# EAGLE design diyhue-IO (EAGLE 9.5.1)
COPYRIGHT: © 2016 luani.de; LICENSE: CC-BY-SA 4.0; PROJEKT: EPS8266 HV I/O Modul; REVISION: 1.0

## Sheet 1 of 2
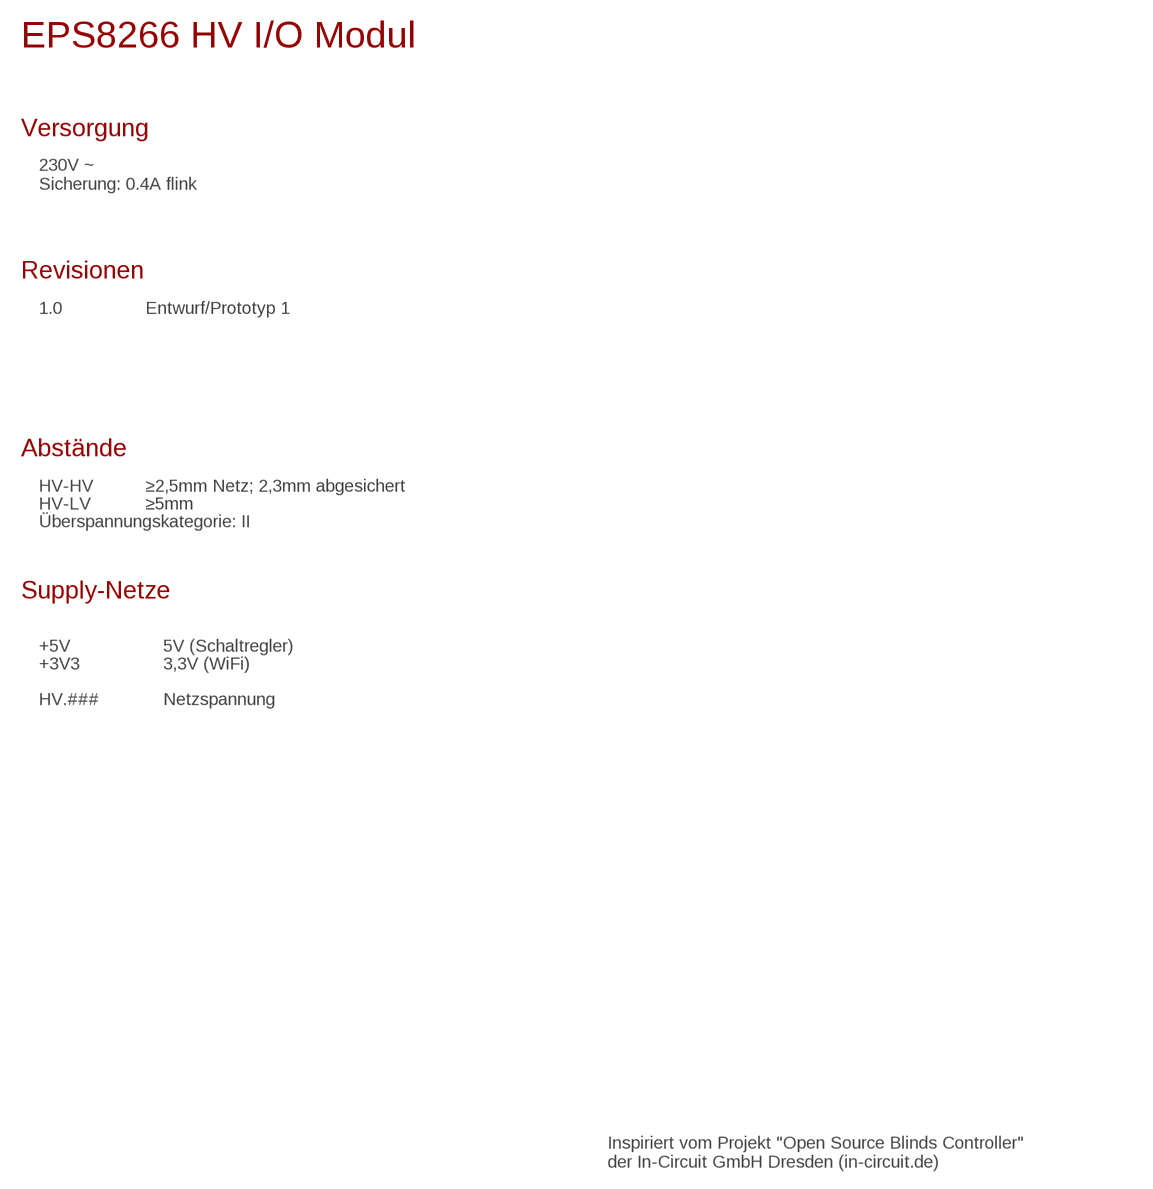
[diagram p0: schematic, sheet 1]

### Notes on the sheet
- Versorgung
- 230V ~
  Sicherung: 0.4A flink
- Revisionen
- 1.0 | Entwurf/Prototyp 1
- Abstände
- HV-HV | ≥2,5mm Netz; 2,3mm abgesichert
- HV-LV | ≥5mm
- Überspannungskategorie: II
- Supply-Netze
- +5V | 5V (Schaltregler)
- +3V3 | 3,3V (WiFi)
- HV.### | Netzspannung
- Inspiriert vom Projekt "Open Source Blinds Controller"
  der In-Circuit GmbH Dresden (in-circuit.de)

## Sheet 2 of 2
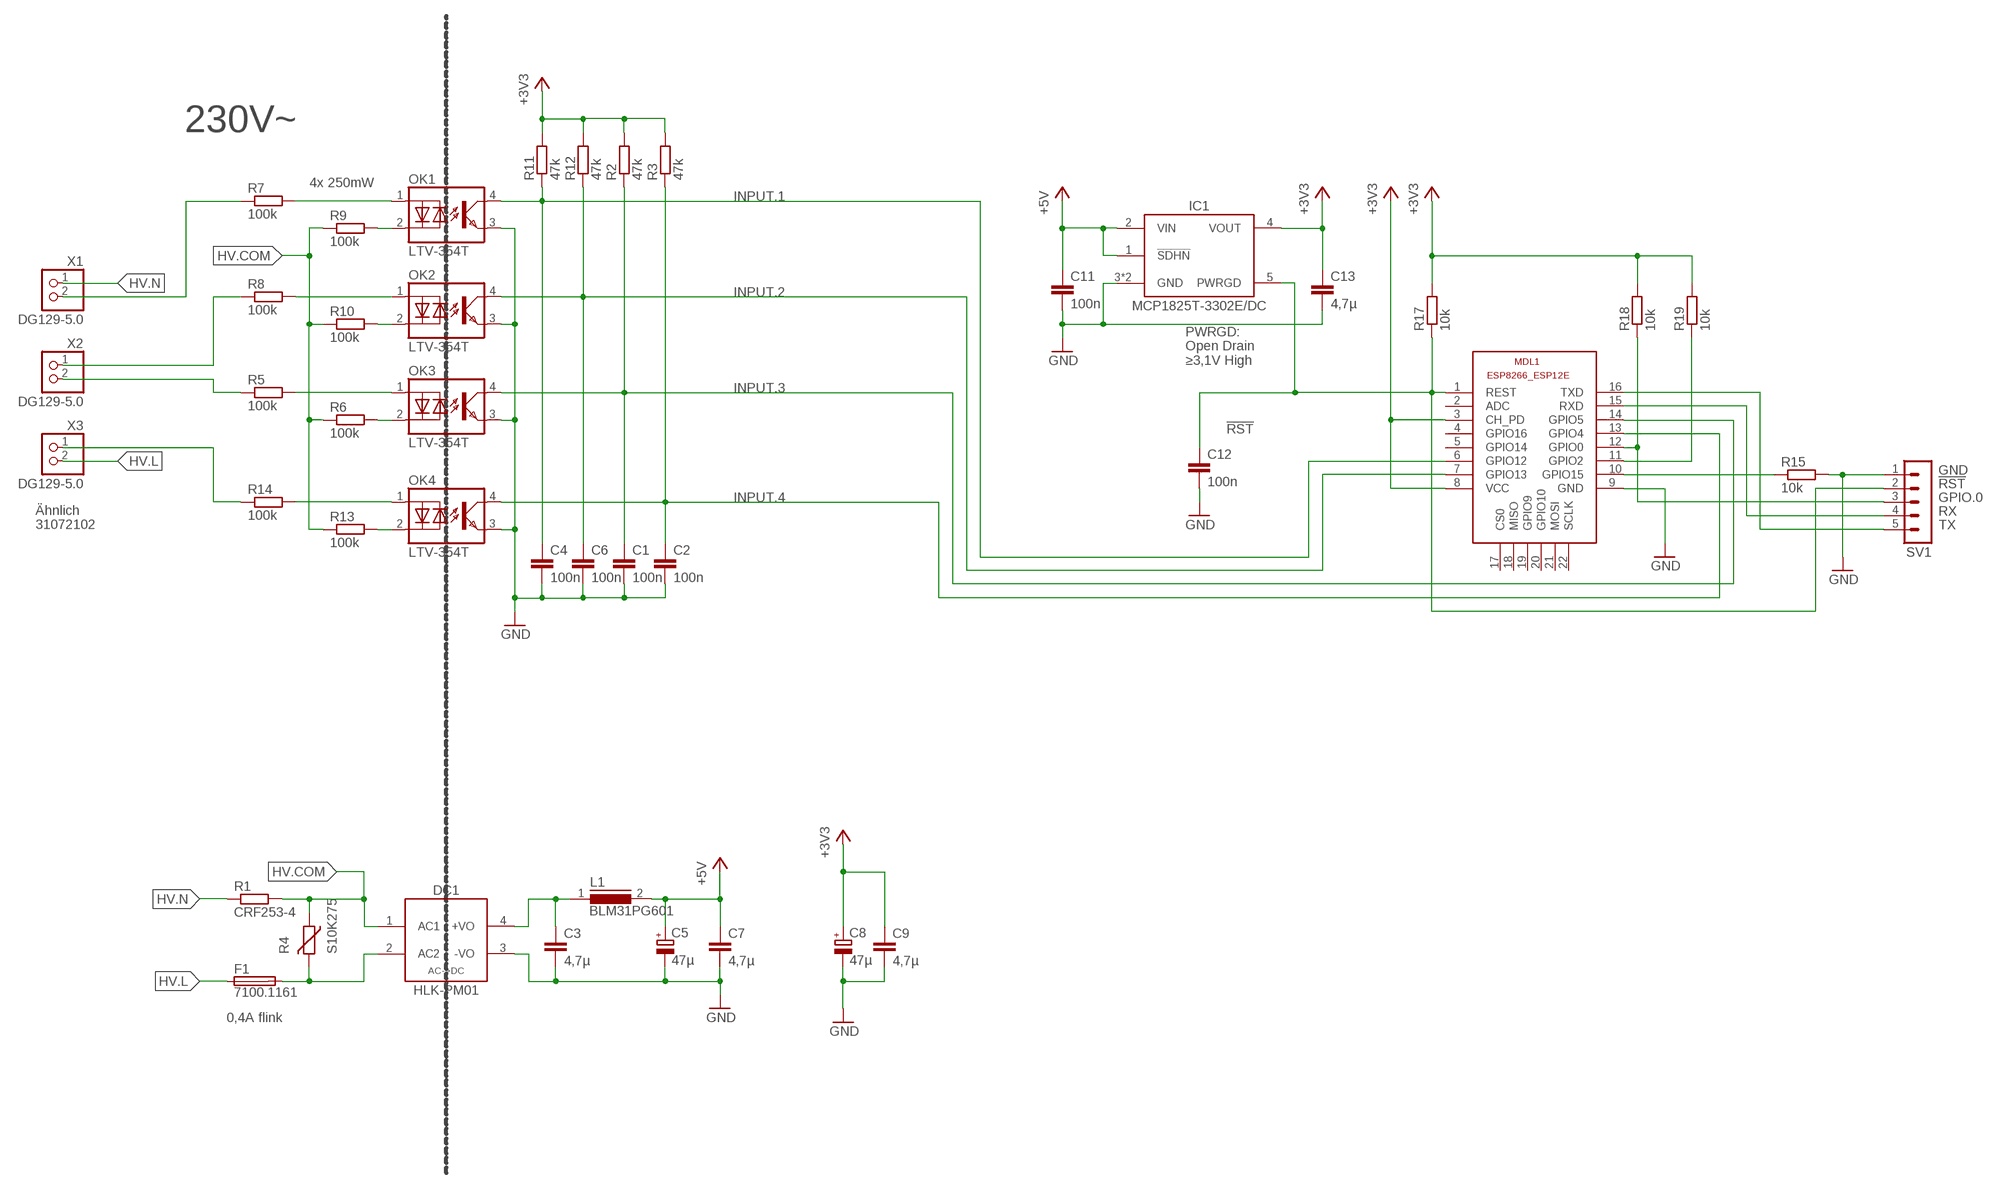
[diagram p1: schematic, sheet 2]

### Parts
C1  100n  C-EUC0805K  [C0805K]
C2  100n  C-EUC0805K  [C0805K]
C3  4,7µ  C-EUC0805K  [C0805K]
C4  100n  C-EUC0805K  [C0805K]
C5  47µ  CPOL-EUE2-5  [E2-5]
C6  100n  C-EUC0805K  [C0805K]
C7  4,7µ  C-EUC0805K  [C0805K]
C8  47µ  CPOL-EUE2-5  [E2-5]
C9  4,7µ  C-EUC0805K  [C0805K]
C11  100n  C-EUC0805K  [C0805K]
C12  100n  C-EUC0805K  [C0805K]
C13  4,7µ  C-EUC0805K  [C0805K]
DC1  HLK-PM01  ACDC-S-HLK_PM01  [HLK_PM01]
F1  7100.1161  FUSE-FRT250  [SCHURTER_FRT250]
IC1  MCP1825T-3302E/DC  MCP1825/DC  [SOT-223/5]
L1  BLM31PG601  INDUCTOR-BLM31  [BLM31P]
MDL1  ESP8266-12EESP8266-ESP12E  [ESP8266-ESP12E]
OK1  LTV-354T  OC-AC_LTV-354  [LITEON_LTV-354]
OK2  LTV-354T  OC-AC_LTV-354  [LITEON_LTV-354]
OK3  LTV-354T  OC-AC_LTV-354  [LITEON_LTV-354]
OK4  LTV-354T  OC-AC_LTV-354  [LITEON_LTV-354]
R1  CRF253-4  R-EU_0414/5V  [0414V]
R2  47k  R-EU_R0805W  [R0805W]
R3  47k  R-EU_R0805W  [R0805W]
R4  S10K275  VDR-S10K275  [EPCOS_S10K275]
R5  100k  R-EU_R1210  [R1210]
R6  100k  R-EU_R1210  [R1210]
R7  100k  R-EU_R1210  [R1210]
R8  100k  R-EU_R1210  [R1210]
R9  100k  R-EU_R1210  [R1210]
R10  100k  R-EU_R1210  [R1210]
R11  47k  R-EU_R0805W  [R0805W]
R12  47k  R-EU_R0805W  [R0805W]
R13  100k  R-EU_R1210  [R1210]
R14  100k  R-EU_R1210  [R1210]
R15  10k  R-EU_R0805W  [R0805W]
R17  10k  R-EU_R0805W  [R0805W]
R18  10k  R-EU_R0805W  [R0805W]
R19  10k  R-EU_R0805W  [R0805W]
SV1  MA05-1  [MA05-1]
X1  DG129-5.0  1PIN-2-31012102  [31012102]
X2  DG129-5.0  1PIN-2-31012102  [31012102]
X3  DG129-5.0  1PIN-2-31012102  [31012102]

### Nets
!RST: C12.1 IC1.5(PWRGD) MDL1.1(REST) R17.1 SV1.2
+3V3: C8.+ C9.1 C13.1 IC1.4(VOUT) MDL1.3(CH_PD) MDL1.8(VCC) R2.2 R3.2 R11.2 R12.2 R17.2 R18.2 R19.2
+5V: C5.+ C7.1 C11.1 IC1.1(!SDHN) IC1.2(VIN) L1.2
GND: C1.2 C2.2 C3.2 C4.2 C5.- C6.2 C7.2 C8.- C9.2 C11.2 C12.2 C13.2 DC1.3(-VO) IC1.3(GND) IC1.6(GND) MDL1.9(GND) OK1.3(E) OK2.3(E) OK3.3(E) OK4.3(E) R15.2 SV1.1
GPIO.0: MDL1.12(GPIO0) R18.1 SV1.3
GPIO.2: MDL1.11(GPIO2) R19.1
GPIO.15: MDL1.10(GPIO15) R15.1
HV.COM: DC1.1(AC1) R1.2 R4.1 R6.1 R9.1 R10.1 R13.1
HV.IN1: R7.1 X1.2
HV.IN2: R8.1 X2.1
HV.L: F1.1 X3.2
HV.N: R1.1 X1.1
HV.OUT1: R5.1 X2.2
HV.OUT2: R14.1 X3.1
INPUT.1: C4.1 MDL1.6(GPIO12) OK1.4(C) R11.1
INPUT.2: C6.1 MDL1.7(GPIO13) OK2.4(C) R12.1
INPUT.3: C1.1 MDL1.14(GPIO5) OK3.4(C) R2.1
INPUT.4: C2.1 MDL1.13(GPIO4) OK4.4(C) R3.1
N$1: C3.1 DC1.4(+VO) L1.1
N$2: DC1.2(AC2) F1.2 R4.2
N$12: OK3.2(CA) R6.2
N$13: OK4.2(CA) R13.2
N$14: OK4.1(AC) R14.2
N$16: OK1.2(CA) R9.2
N$17: OK2.2(CA) R10.2
N$18: OK1.1(AC) R7.2
N$19: OK2.1(AC) R8.2
N$20: OK3.1(AC) R5.2
RX: MDL1.15(RXD) SV1.4
TX: MDL1.16(TXD) SV1.5
Unconnected: MDL1.2(ADC) MDL1.4(GPIO16) MDL1.5(GPIO14) MDL1.17(CS0) MDL1.18(MISO) MDL1.19(GPIO9) MDL1.20(GPIO10) MDL1.21(MOSI) MDL1.22(SCLK)

### Notes on the sheet
- ⚠ 230V~
- 4x 250mW
- PWRGD:
  Open Drain
  ≥3,1V High
- Ähnlich
  31072102
- 0,4A flink

## Library data of the parts
C1-C4 C6 C7 C9 C11-C13 = rcl:C-EU: CAPACITOR, European symbol; SPICEPREFIX: C
C5 C8 = rcl:CPOL-EU: POLARIZED CAPACITOR, European symbol; SPICEPREFIX: C
DC1 = luani_modules:ACDC-S: AC->DC Converter, 1 Out
F1 = luani_protection:FUSE: Fuse
IC1 = luani_chips:MCP1825: Microchip LDO
L1 = leo_inductor-fastron:INDUCTOR: Fastron SMD Inductor Footprints: PIS4728, PIS2408, PIS2816, PISR, 1206, 1008
MDL1 = ESP8266-ESP12E:ESP8266-12E: ESP8266-12E with additional I/O and GPIO04/05 corrected The author cannot warrant that this library is free from error or will meet your specific requirements. Created by PuceBaboon.com. Komagane, Nagano, JAPAN
OK1-OK4 = luani_misc-smd:OC-AC: Optocoupler, AC Input
R1 = rcl:R-EU_: RESISTOR, European symbol
R2 R3 R5-R15 R17-R19 = rcl:R-EU_: RESISTOR, European symbol; SPICEPREFIX: R
R4 = luani_protection:VDR: Varistor
SV1 = con-lstb:MA05-1: PIN HEADER; OC_FARNELL: unknown; OC_NEWARK: unknown
X1-X3 = leo_con-ria:1PIN-2: 1 Pin Header, 2 Pole

## Net classes
1 HV-Netz: width 1 mm, clearance 5 mm to class 0, clearance 2.5 mm
2 HV-gesichert: width 0.3 mm, clearance 5 mm to class 0, clearance 2.3 mm to class 1, clearance 2.3 mm

## Board
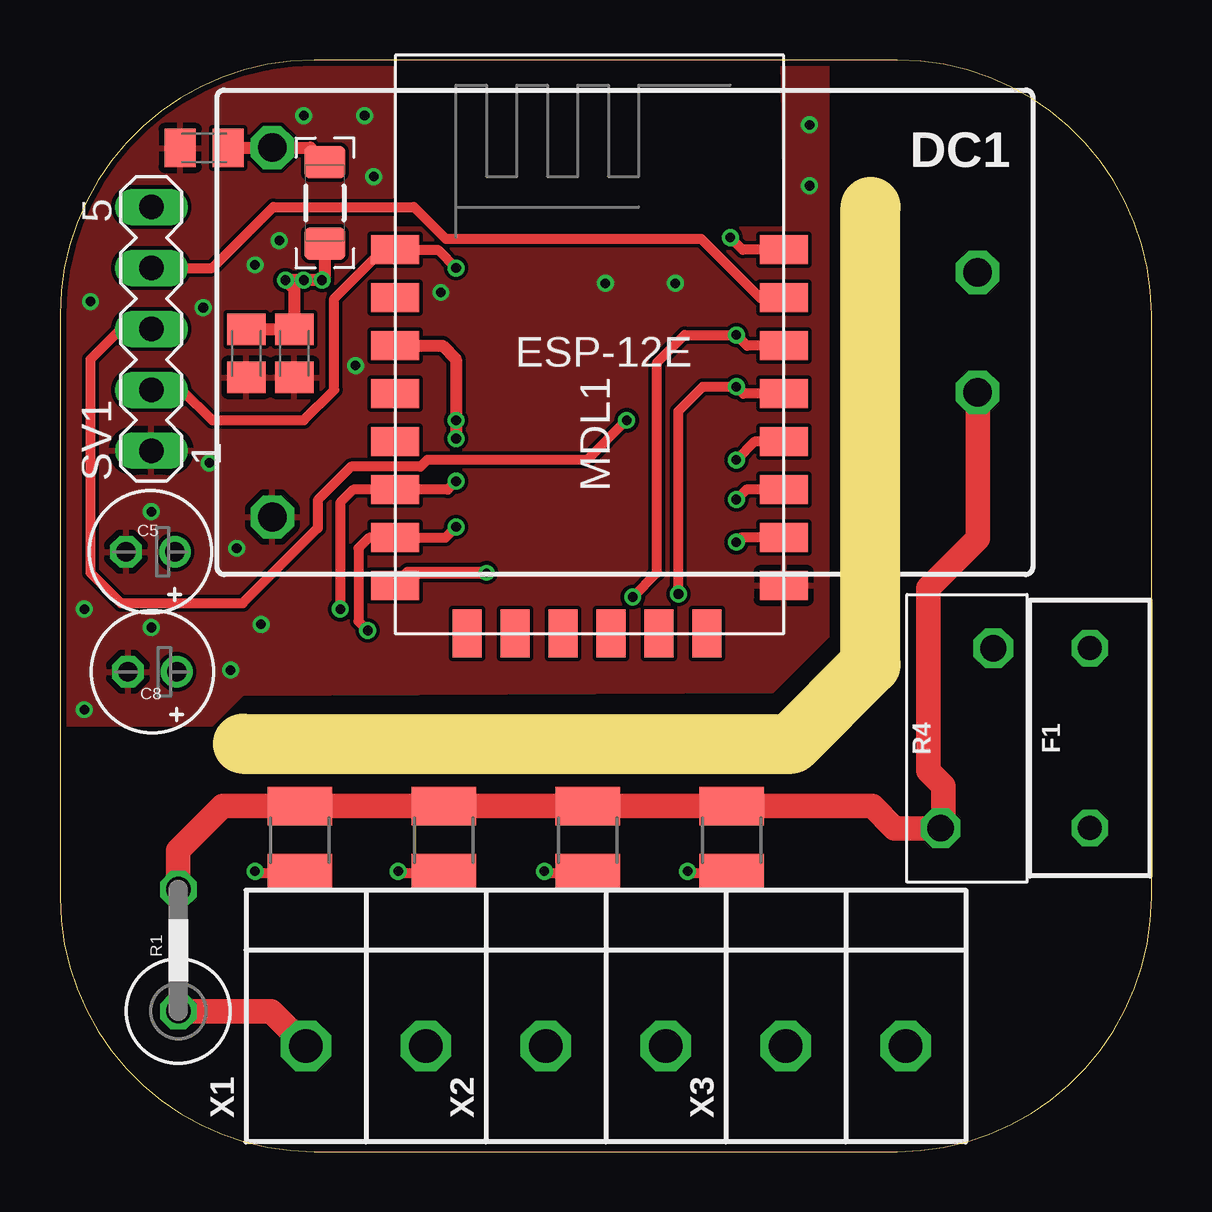
[diagram p2: board, top side]
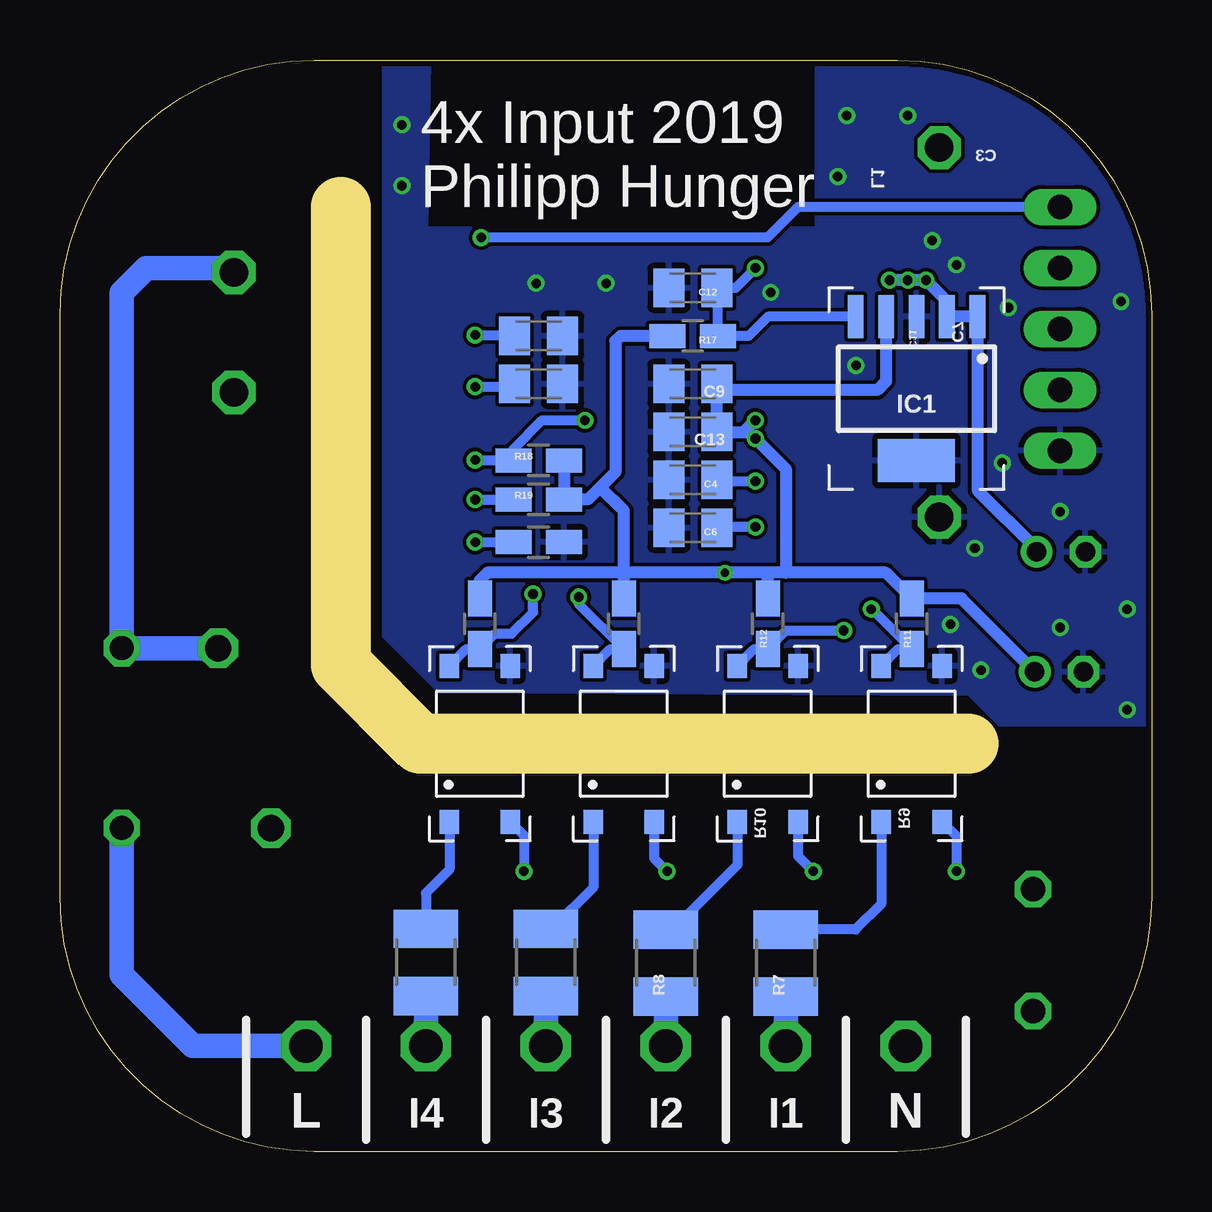
[diagram p3: board, bottom side, seen from below]

Size 45.5 x 45.5 mm. Coordinates in mm from the lower left corner, seen from the top.
Outline: 34.9,45.5 10.6,45.5 arc90 0,34.9 0,10.6 arc90 10.6,0 34.9,0 arc90 45.5,10.6 45.5,34.9 arc90 34.9,45.5
Copper layers (1*16): Top 0.035mm / dielectric 1.5mm / Bottom 0.035mm
Design rules "Elecrow_2-layer_eagle_rule": minimum track width 6mil, minimum drill 12mil, track to track 6mil, track to pad 6mil, pad to pad 6mil, via to via 6mil, smd to smd 0mil, copper to edge 10mil, drill to drill 10mil, minimum pad ring 10mil, minimum via ring 6mil, stop-mask expansion 2mil, vias tented up to drill 100mil, thermal gap 10mil
Milling: 3 lines

### Footprints (pad centres in the part's own frame; a part is rotated, then mirrored left to right if it is on the bottom)
C0805K = smd 1.3 x 1.6: 1 -1,0; 2 1,0
E2-5 = drill 0.813 pad 1.27: + -1.016,0 | drill 0.813 pad 1.27 octagon: - 1.016,0
HLK_PM01 = drill 1.2 octagon: 1 -14.7,2.5; 2 -14.7,-2.5; 3 14.7,7.7; 4 14.7,-7.7
SCHURTER_FRT250 = drill 1 octagon: 1 -3.75,0; 2 3.75,0
SOT-223/5 = smd 0.65 x 1.8: 1 -2.54,-3; 2 -1.27,-3; 3 0,-3; 4 1.27,-3; 5 2.54,-3 | smd 3.2 x 1.8: 6 0,3
BLM31P = smd 1.35 x 1.7: 1 -1.7,0; 2 1.7,0
ESP8266-ESP12E = smd 2 x 1.2: 1 0,16; 2 0,14; 3 0,12; 4 0,10; 5 0,8; 6 0,6; 7 0,4; 8 0,2; 9 16.2,2; 10 16.2,4; 11 16.2,6; 12 16.2,8; 13 16.2,10; 14 16.2,12; 15 16.2,14; 16 16.2,16 | smd 1.2 x 2: 17 11,0; 18 3,0; 19 5,0; 20 13,0; 21 7,0; 22 9,0
LITEON_LTV-354 = smd 1 x 0.8: 1 -3.25,1.27; 2 -3.25,-1.27; 3 3.25,-1.27; 4 3.25,1.27
0414V = drill 1.016 octagon: 1 -2.54,0; 2 2.54,0
R0805W = smd 1.5 x 1: 1 -1.052,0; 2 1.052,0
EPCOS_S10K275 = drill 1.1 octagon: 1 -3.75,1.1; 2 3.75,-1.1
R1210 = smd 1.6 x 2.7: 1 -1.4,0; 2 1.4,0
MA05-1 = drill 1.016 long: 1 -5.08,0; 2 -2.54,0; 3 0,0; 4 2.54,0; 5 5.08,0
31012102 = drill 1.4 octagon: 1 4,2.5; 2 4,-2.5

### Placement (x,y rotation side)
C1  25.55,34 0 bottom
C2  25.55,32 0 bottom
C3  6.01,41.83 180 top
C4  19.12,28 180 bottom
C5  3.77,25 180 top
C6  19.12,26 180 bottom
C7  7.77,33.27 270 top
C8  3.85,20 180 top
C9  19.12,32 180 bottom
C11  9.77,33.27 270 top
C12  19.12,36 180 bottom
C13  19.12,30 180 bottom
DC1  23.55,34.15 180 top
F1  42.93,17.23 90 top
IC1  9.8,31.8 180 bottom
L1  11.04,39.54 270 top
MDL1  13.97,21.59 0 top
OK1  10,17 90 bottom
OK2  16,17 90 bottom
OK3  22,17 90 bottom
OK4  28,17 90 bottom
R1  4.93,8.39 90 top
R2  22,22 90 bottom
R3  28,22 90 bottom
R4  37.81,17.22 90 top
R5  25.25,7.88 90 bottom
R6  22,13 270 top
R7  15.25,7.85 90 bottom
R8  20.25,7.85 90 bottom
R9  10,13 270 top
R10  16,13 270 top
R11  10,22 90 bottom
R12  16,22 90 bottom
R13  28,13 270 top
R14  30.25,7.88 90 bottom
R15  25.55,25.4 0 bottom
R17  19.12,34 180 bottom
R18  25.55,28.8 0 bottom
R19  25.55,27.18 0 bottom
SV1  3.81,34.29 90 top
X1  12.75,0.4 90 top
X2  22.75,0.4 90 top
X3  32.75,0.4 90 top

### Tracks (layer width: path | path; a pad name or v marks a point on that pad's centre or on a via)
!RST  (via drill 0.4)
  Top 0.406: v16.51,36.83 15.75,37.59 MDL1.1 13.46,37.59 11.43,35.56 11.43,31.75 10.16,30.48 6.35,30.48 5.08,31.75 SV1.2
  Bottom 0.152: 18.07,35.95 C12.1
  Bottom 0.406: v16.51,36.83 17.34,36 C12.1 | IC1.5 16,34.8 16.8,34 R17.1 18.07,35.95
+3V3  (via drill 0.35, 0.4)
  Top 0.508: MDL1.3 15.94,33.59 16.51,33.02 v16.51,30.48 v16.51,29.72 | MDL1.8 14.51,24.13 v17.78,24.13
  Bottom 0.508: IC1.4 11.07,32.11 11.43,31.75 17.87,31.75 C9.1 C13.1 | C13.1 16.99,30 v16.51,30.48 | C13.1 16.79,30 v16.51,29.72 15.24,28.45 15.24,24.13 | R17.2 22.13,34 22.35,33.78 22.35,28.32 22.99,27.69 | 22.99,27.69 23.5,27.18 R19.2 R18.2 | C8.+ 7.92,23.05 R11.2 11.08,24.13 15.24,24.13 | 15.24,24.13 16,24.13 | 16,24.13 v17.78,24.13 22.1,24.13 | R12.2 16,24.13 | 22.1,24.13 22,24.03 R2.2 22,26.7 22.99,27.69 | 22.1,24.13 27.69,24.13 28,23.82 R3.2
+5V  (via drill 0.4)
  Top 0.508: C7.1 C11.1 9.77,35.95 v9.4,36.32 v10.16,36.32 v10.92,36.32 11.04,36.44 L1.2
  Bottom 0.508: v10.92,36.32 v10.16,36.32 v9.4,36.32 8.53,35.45 IC1.2 IC1.1 7.26,27.58 4.79,25.11 C5.+
GND  (via drill 0.4)
  other vias: 12.7,43.18 10.16,43.18 3.81,26.67 22.73,36.2 25.65,36.2 31.24,42.8 31.24,40.26 13.08,40.64 1.27,35.43 1.02,22.61 1.02,18.41 7.11,20.07 8.38,21.97 7.37,25.15 3.81,21.84 6.22,28.7 5.97,35.18 8.13,36.96 9.14,37.97 12.32,32.77 15.88,35.81
  pour Bottom: 0,17.78 6.35,17.78 7.62,19.05 29.72,19.18 32,21.46 32,45.47 30.1,45.47 30.23,38.48 13.97,38.48 13.97,45.72 6.35,45.72 0,39.37
  pour Top: 0,17.78 6.35,17.78 7.62,19.05 29.72,19.18 32,21.46 32,45.47 30.1,45.47 30.22,38.48 13.97,38.48 13.97,45.72 6.35,45.72 0,39.37
GPIO.0  (via drill 0.4)
  Top 0.406: MDL1.12 28.95,29.59 v28.19,28.83 | v23.62,30.48 21.97,28.83 15.31,28.83 15.03,28.55 12.13,28.55 10.74,27.16 10.74,25.98 7.62,22.86 2.54,22.86 1.27,24.13 1.27,33.02 2.54,34.29 SV1.3
  Bottom 0.152: 26.63,28.83 R18.1
  Bottom 0.406: v28.19,28.83 26.63,28.83 | R18.1 26.6,29.28 25.4,30.48 v23.62,30.48
GPIO.2  (via drill 0.4)
  Top 0.406: MDL1.11 28.61,27.59 v28.19,27.18
  Bottom 0.152: R19.1
  Bottom 0.406: v28.19,27.18 R19.1
GPIO.15  (via drill 0.4)
  Top 0.406: MDL1.10 28.38,25.59 v28.19,25.4
  Bottom 0.406: v28.19,25.4 R15.1
HV.COM
  Top 1.016: R1.2 4.93,12.55 6.78,14.4 R9.1 R10.1 R6.1 R13.1 33.86,14.4 34.79,13.47 R4.1 36.83,13.6 36.83,15.24 36.2,15.88 36.2,23.5 38.25,25.55 DC1.1
HV.IN1
  Bottom 1.016: X1.2 R7.1
HV.IN2
  Bottom 1.016: X2.1 R8.1
HV.L
  Bottom 1.016: X3.2 39.96,4.4 42.93,7.37 F1.1
HV.N
  Top 1.016: R1.1 8.8,5.85 X1.1
HV.OUT1
  Bottom 1.016: X2.2 R5.1
HV.OUT2
  Bottom 1.016: X3.1 R14.1
INPUT.1  (via drill 0.4)
  Top 0.406: v16.51,27.94 16.16,27.59 MDL1.6 12.22,27.59 11.68,27.05 v11.68,22.61
  Bottom 0.152: C4.1 18.06,27.94
  Bottom 0.406: 18.06,27.94 v16.51,27.94 | OK1.4 10.57,20.95 R11.1 11.66,22.61 v11.68,22.61
INPUT.2  (via drill 0.4)
  Top 0.406: v16.51,26.04 16.07,25.59 MDL1.7 12.89,25.59 12.45,25.15 12.45,22.1 v12.83,21.72
  Bottom 0.152: 18.09,26.04 C6.1
  Bottom 0.406: v16.51,26.04 18.09,26.04 | OK2.4 16.57,20.95 R12.1 15.23,21.72 v12.83,21.72
INPUT.3  (via drill 0.4)
  Top 0.406: MDL1.14 28.64,33.59 v28.19,34.04 26.04,34.04 24.89,32.89 24.89,24.13 v23.88,23.11
  Bottom 0.152: 26.59,34.04 C1.1
  Bottom 0.406: v28.19,34.04 26.59,34.04 | OK3.4 22.57,20.95 R2.1 23.88,22.82 v23.88,23.11
INPUT.4  (via drill 0.4)
  Top 0.406: MDL1.13 28.48,31.59 v28.19,31.88 26.8,31.88 25.78,30.86 v25.78,23.24
  Bottom 0.152: 26.67,31.88 C2.1
  Bottom 0.406: v28.19,31.88 26.67,31.88 | v25.78,23.24 25.78,22.48 26.67,21.59 27.36,21.59 R3.1 28.57,20.95 OK4.4
N$1
  Top 0.508: C3.1 7.03,41.85 DC1.4 10.43,41.85 L1.1
N$2
  Bottom 1.016: DC1.2 38.43,36.83 41.91,36.83 42.93,35.81 F1.2 R4.2
N$12  (via drill 0.4)
  Top 0.406: R6.2 20.28,11.6 v20.19,11.68
  Bottom 0.3: OK3.2 20.73,13.11
  Bottom 0.406: OK3.2 20.73,12.22 v20.19,11.68
N$13  (via drill 0.4)
  Top 0.406: R13.2 26.25,11.6 v26.16,11.68
  Bottom 0.406: OK4.2 26.16,13.18 v26.16,11.68
N$14
  Bottom 0.406: R14.2 30.25,10.77 29.27,11.75 OK4.1
N$16  (via drill 0.4)
  Top 0.406: R9.2 8.21,11.6 v8.13,11.68
  Bottom 0.406: OK1.2 8.13,13.15 v8.13,11.68
N$17  (via drill 0.4)
  Top 0.406: R10.2 14.18,11.6 v14.1,11.68
  Bottom 0.406: OK2.2 14.73,12.32 v14.1,11.68
N$18
  Bottom 0.406: R7.2 12.34,9.25 11.27,10.32 OK1.1
N$19
  Bottom 0.406: OK2.1 17.27,11.94 19.96,9.25 R8.2
N$20
  Bottom 0.406: OK3.1 23.27,11.02 25.01,9.28 R5.2
RX
  Top 0.406: SV1.4 6.35,36.83 8.89,39.37 14.76,39.37 16.08,38.05 26.72,38.05 29.21,35.56 30.14,35.56 MDL1.15
TX  (via drill 0.4)
  Top 0.406: MDL1.16 28.45,37.59 v27.94,38.1
  Bottom 0.406: SV1.5 14.73,39.37 16,38.1 v27.94,38.1

### Text on the board
bPlace: 4x Input 2019 / Philipp Hunger | N | I1 | I2 | I3 | I4 | L